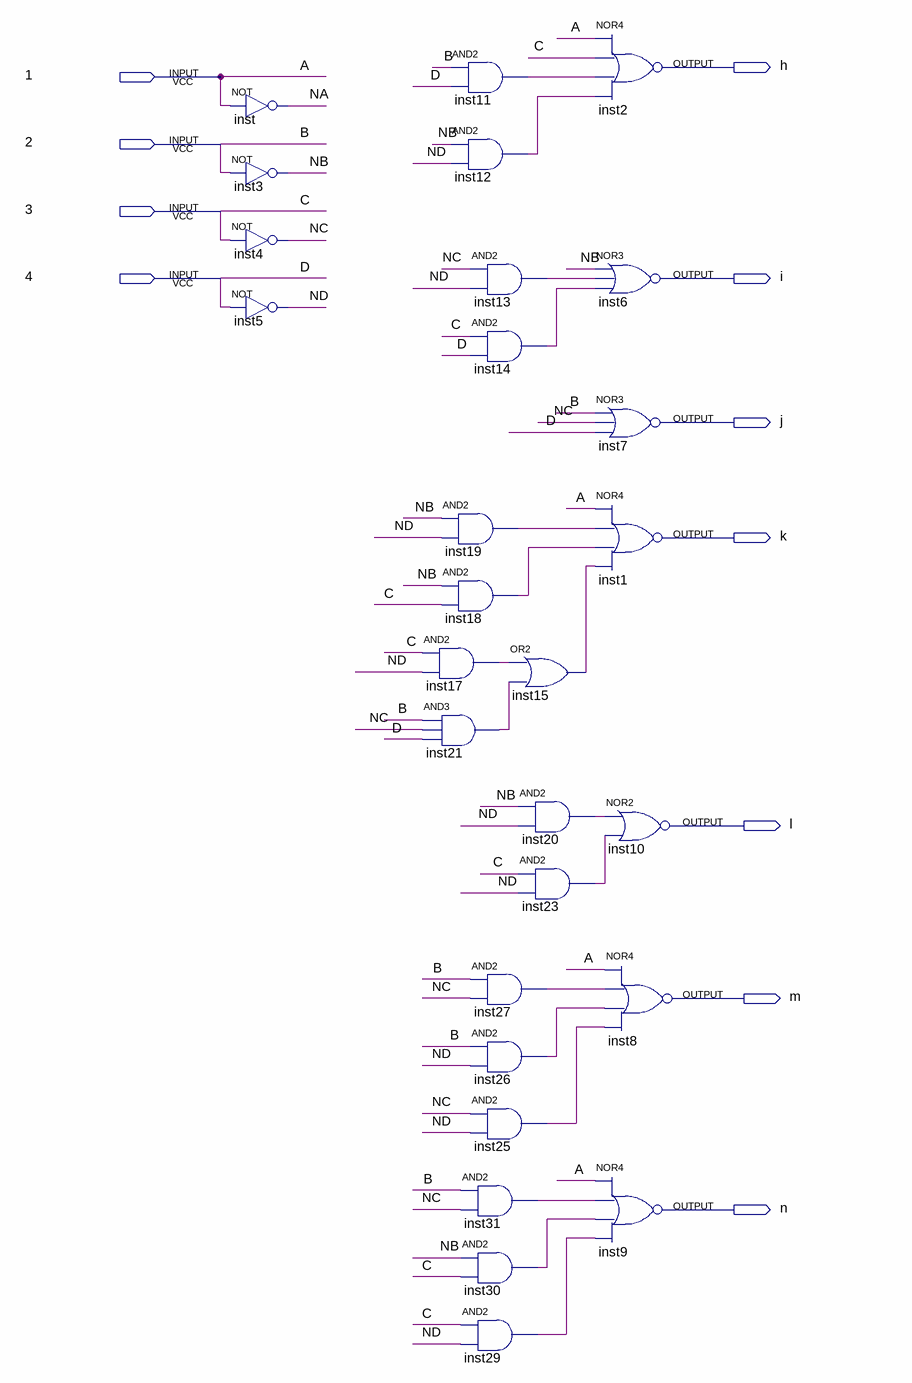
[diagram p0: schematic sheet]
// Quartus schematic box.bdf as structural Verilog: 28 symbols, 11 pins
module box (
  input  \1 ,
  input  \2 ,
  input  \3 ,
  input  \4 ,
  output h,
  output i,
  output j,
  output k,
  output l,
  output m,
  output n
);

  wire inst11_out, inst12_out, inst13_out, inst14_out, inst15_out, inst17_out, inst18_out, inst19_out,
       inst20_out, inst21_out, inst23_out, inst25_out, inst26_out, inst27_out, inst29_out, inst30_out,
       inst31_out, NA, NB, NC, ND;

  not inst (NA, \1 );
  not inst3 (NB, \2 );
  not inst4 (NC, \3 );
  not inst5 (ND, \4 );
  and inst11 (inst11_out, \2 , \4 );
  and inst12 (inst12_out, NB, ND);
  and inst13 (inst13_out, NC, ND);
  and inst14 (inst14_out, \3 , \4 );
  and inst19 (inst19_out, NB, ND);
  and inst18 (inst18_out, NB, \3 );
  and inst17 (inst17_out, \3 , ND);
  and inst21 (inst21_out, \2 , NC, \4 );
  and inst27 (inst27_out, \2 , NC);
  and inst26 (inst26_out, \2 , ND);
  and inst25 (inst25_out, NC, ND);
  and inst31 (inst31_out, \2 , NC);
  and inst30 (inst30_out, NB, \3 );
  and inst29 (inst29_out, \3 , ND);
  or inst15 (inst15_out, inst17_out, inst21_out);
  and inst20 (inst20_out, NB, ND);
  and inst23 (inst23_out, \3 , ND);
  nor inst2 (h, \1 , \3 , inst11_out, inst12_out);
  nor inst6 (i, NB, inst13_out, inst14_out);
  nor inst7 (j, \2 , NC, \4 );
  nor inst1 (k, \1 , inst19_out, inst18_out, inst15_out);
  nor inst10 (l, inst20_out, inst23_out);
  nor inst8 (m, \1 , inst27_out, inst26_out, inst25_out);
  nor inst9 (n, \1 , inst31_out, inst30_out, inst29_out);

  // Other names for the same wires on the sheet: A = \1 ; B = \2 ; C = \3 ; D = \4 
endmodule
